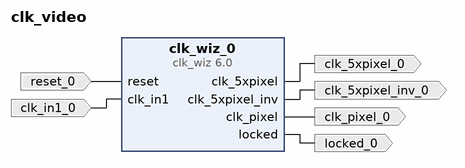
[diagram p0: block diagram of the top level]
# Vivado block design clk_video, xc7s50csga324-2, Vivado 2018.1
create_bd_design clk_video

create_bd_port -dir I -type rst reset_0
set_property -dict {CONFIG.POLARITY ACTIVE_HIGH} [get_bd_ports reset_0]
create_bd_port -dir I -type clk clk_in1_0
create_bd_port -dir O locked_0
create_bd_port -dir O -type clk clk_pixel_0
set_property -dict {CONFIG.FREQ_HZ 74250000} [get_bd_ports clk_pixel_0]
create_bd_port -dir O -type clk clk_5xpixel_0
set_property -dict {CONFIG.FREQ_HZ 371250000} [get_bd_ports clk_5xpixel_0]
create_bd_port -dir O -type clk clk_5xpixel_inv_0
set_property -dict {CONFIG.FREQ_HZ 371250000} [get_bd_ports clk_5xpixel_inv_0]

create_bd_cell -type ip -vlnv xilinx.com:ip:clk_wiz:6.0 clk_wiz_0
set_property -dict [list \
  CONFIG.CLKOUT2_USED true \
  CONFIG.CLKOUT3_USED true \
  CONFIG.NUM_OUT_CLKS 3 \
  CONFIG.CLK_OUT1_PORT clk_pixel \
  CONFIG.CLK_OUT2_PORT clk_5xpixel \
  CONFIG.CLK_OUT3_PORT clk_5xpixel_inv \
  CONFIG.CLKOUT1_REQUESTED_OUT_FREQ 74.25 \
  CONFIG.CLKOUT2_REQUESTED_OUT_FREQ 371.25 \
  CONFIG.CLKOUT3_REQUESTED_OUT_FREQ 371.25 \
  CONFIG.CLKOUT3_REQUESTED_PHASE 180 \
  CONFIG.MMCM_DIVCLK_DIVIDE 5 \
  CONFIG.MMCM_CLKFBOUT_MULT_F 37.125 \
  CONFIG.MMCM_CLKOUT0_DIVIDE_F 10.000 \
  CONFIG.MMCM_CLKOUT1_DIVIDE 2 \
  CONFIG.MMCM_CLKOUT2_DIVIDE 2 \
  CONFIG.MMCM_CLKOUT2_PHASE 180.000 \
  CONFIG.CLKOUT1_JITTER 337.616 \
  CONFIG.CLKOUT1_PHASE_ERROR 322.999 \
  CONFIG.CLKOUT2_JITTER 258.703 \
  CONFIG.CLKOUT2_PHASE_ERROR 322.999 \
  CONFIG.CLKOUT3_JITTER 258.703 \
  CONFIG.CLKOUT3_PHASE_ERROR 322.999 \
] [get_bd_cells clk_wiz_0]

# ---- connections ----

connect_bd_net -net reset_0_1 [get_bd_ports reset_0] [get_bd_pins clk_wiz_0/reset]
connect_bd_net -net clk_in1_0_1 [get_bd_ports clk_in1_0] [get_bd_pins clk_wiz_0/clk_in1]
connect_bd_net [get_bd_pins clk_wiz_0/locked] [get_bd_ports locked_0]
connect_bd_net [get_bd_pins clk_wiz_0/clk_pixel] [get_bd_ports clk_pixel_0]
connect_bd_net [get_bd_pins clk_wiz_0/clk_5xpixel] [get_bd_ports clk_5xpixel_0]
connect_bd_net [get_bd_pins clk_wiz_0/clk_5xpixel_inv] [get_bd_ports clk_5xpixel_inv_0]

validate_bd_design
save_bd_design
